# Altium schematic sheet 2_Power.SchDoc
size A
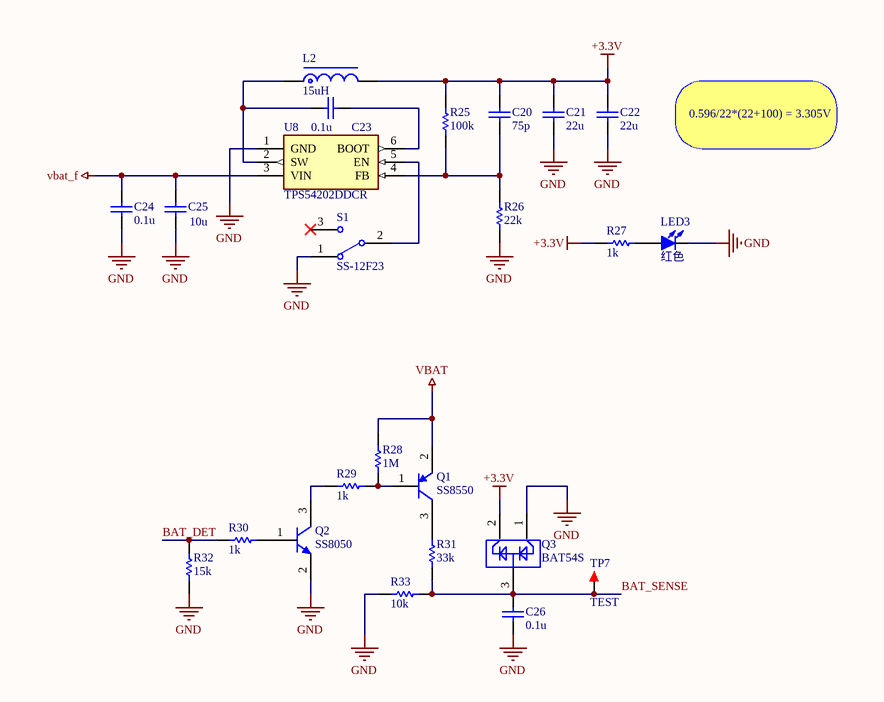
[diagram p0: 2_Power.SchDoc]

## Parts
C20  75p  [CAP_0603_SMD]
C21  22u  [C1206_L]
C22  22u  [C1206_L]
C23  0.1u  [CAP_0603_SMD]
C24  0.1u  [CAP_0603_SMD]
C25  10u  [C1206_L]
C26  0.1u  [CAP_0603_SMD]
L2  15uH  [L-SMD-0630]
LED3  红色  [LED0603_Y]
Q1  SS8550  [TR_SOT-23]
Q2  SS8050  [TR_SOT-23]
Q3  BAT54S  [TR_SOT-23]
R25  100k  [RES_0603_SMD]
R26  22k  [RES_0603_SMD]
R27  1k  [RES_0603_SMD]
R28  1M  [RES_0603_SMD]
R29  1k  [RES_0603_SMD]
R30  1k  [RES_0603_SMD]
R31  33k  [RES_0603_SMD]
R32  15k  [RES_0603_SMD]
R33  10k  [RES_0603_SMD]
S1  SS-12F23  [SS-12F23]
TP7  TEST  [TEST 1.2]
U8  TPS54202DDCR  [SOT95P280X110-6N]

## Nets
+3.3V: C20.1 C21.2 C22.2 L2.2 Q3.2 R25.2 R27.2
GND: C21.1 C22.1 C24.1 C25.1 C26.1 LED3.2(K) Q2.2(E) Q3.1 R26.1 R32.1 R33.1 S1.1 U8.1(GND)
VBAT: Q1.2(E) R28.2
vbat_f: C24.2 C25.2 U8.3(VIN)
BAT_DET: R30.1 R32.2
BAT_SENSE: C26.2 Q3.3 R31.2 R33.2 TP7.1
NetC20_2: C20.2 R25.1 R26.2 U8.4(FB)
NetC23_1: C23.1 U8.6(BOOT)
NetC23_2: C23.2 L2.1 U8.2(SW)
NetLED3_1: LED3.1(A) R27.1
NetQ1_1: Q1.1(B) R28.1 R29.1
NetQ1_3: Q1.3(C) R31.1
NetQ2_1: Q2.1(B) R30.2
NetQ2_3: Q2.3(C) R29.2
NetS1_2: S1.2 U8.5(EN)

Not connected (* = marked no-connect by the designer): S1 3*

## Notes on the sheet
- 0.596/22*(22+100) = 3.305V

## Library data of the parts
C20 C23 C24 C26 = CAP_0603_SMD: Capacitor, 0603, SMD; Published: 8-Jun-2000; LatestRevisionDate: 17-Jul-2002; LatestRevisionNote: Re-released for DXP Platform.; PackageReference: RAD-0.3; Publisher: Altium Limited
C21 C22 C25 = C: 贴片电容; BOM名称: 无极性贴片电容; 联系卖家，免费查找封装: 唯一出售店铺网址https://shop463601444.taobao.com; 封装库来自淘宝卖家ID：黄晶宝石: 其他店铺购入均为盗版假冒封装库，请立即申请退款
L2 = L-Molding Choke: 一体成型电感; 联系卖家，免费查找封装: 唯一出售店铺网址https://shop463601444.taobao.com; 封装库来自淘宝卖家ID：黄晶宝石: 其他店铺购入均为盗版假冒封装库，请立即申请退款; BOM名称: 一体成型电感
LED3 = LED-SMD: 贴片LED; 封装库来自淘宝卖家 ID：黄晶宝石: 其他店铺购入均为假冒，请立即申请退款，本店奖励现金5~20元; BOM名称: 贴片LED
Q1 = PNP SS8550: PNP SS8550, -25V -1.5A, SOT-23; Published: 8-Jun-2000; LatestRevisionDate: 29-May-2009; LatestRevisionNote: IPC-7351 Footprint Added.; PackageVersion: Aug-1999; PackageReference: SOT-23B; Publisher: Altium Limited; PackageDescription: 3-Pin SOT-23 Package 0.95 mm Pitch, 2.4 mm Lead Span
Q2 = NPN SS8050: NPN SS8050, 25V 1.5A, SOT-23; Published: 8-Jun-2000; LatestRevisionDate: 17-Jul-2002; LatestRevisionNote: Re-released for DXP Platform.; PackageReference: TO-226; Publisher: Altium Limited; Code_JEDEC: TO-226-AA
Q3 = BAT54S: Dual Schottky Diodes, SOT23
R25-R33 = RES_0603_SMD: Resistor, 0603, SMD; Published: 8-Jun-2000; LatestRevisionDate: 17-Jul-2002; LatestRevisionNote: Re-released for DXP Platform.; PackageReference: AXIAL-0.3; Publisher: Altium Limited; Value: Value
S1 = SSW-1P: 1路波动开关; BOM名称: 波动开关; 联系卖家，免费查找封装: 唯一出售店铺网址https://shop463601444.taobao.com
TP7 = TEST: 测试点; 联系卖家，免费查找封装: 唯一出售店铺网址https://shop463601444.taobao.com; BOM名称: 测试点
U8 = TPS54202DDCR: Power Supply; Manufacturer_Name: Texas Instruments; Datasheet Link: http://www.ti.com/lit/gpn/tps54202; Height: 1.1mm; Manufacturer_Part_Number: TPS54202DDCR; Arrow Part Number: TPS54202DDCR; Arrow Price/Stock: https://www.arrow.com/en/products/tps54202ddcr/texas-instruments; Mouser Part Number: 595-TPS54202DDCR; Mouser Price/Stock: https://www.mouser.co.uk/ProductDetail/Texas-Instruments/TPS54202DDCR?qs=uP22XH7NdCsJtN%2Fq54jCtQ%3D%3D